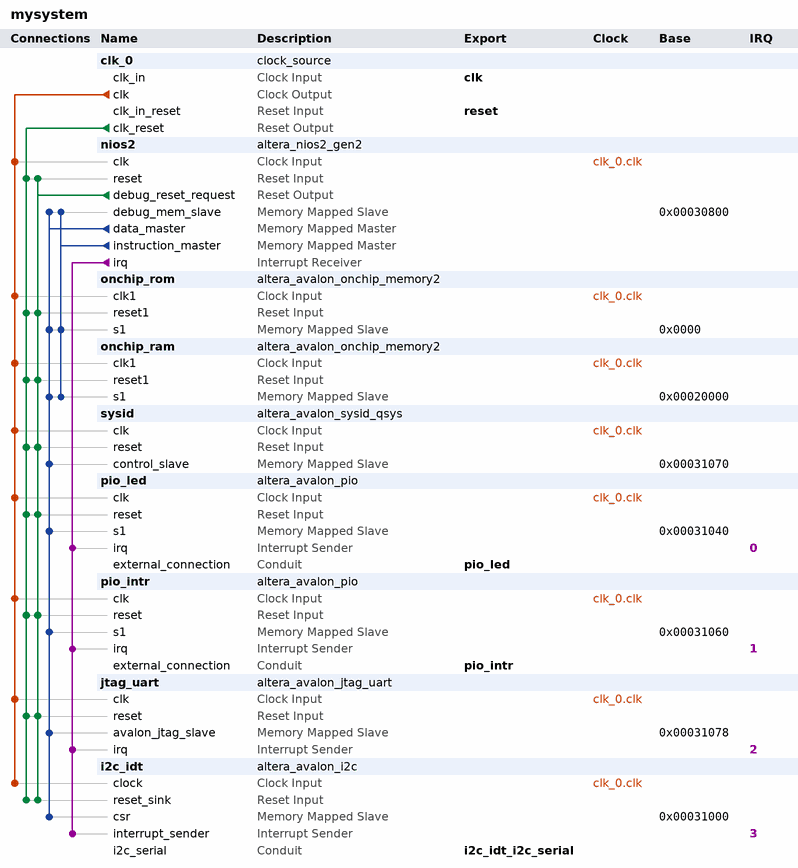
[diagram p0: system contents]
# Platform Designer (Qsys) system mysystem, Stratix V 5SGSMD5K1F40C1
# Parameters at their usual value, and those the tool derives, are not listed.
package require -exact qsys 18.1
create_system mysystem
set_project_property DEVICE_FAMILY {Stratix V}
set_project_property DEVICE 5SGSMD5K1F40C1

add_instance clk_0 clock_source 18.1
set_instance_parameter_value clk_0 clockFrequency 125000000

add_instance nios2 altera_nios2_gen2 18.1
set_instance_parameter_value nios2 dcache_size 2048
set_instance_parameter_value nios2 exceptionSlave onchip_ram.s1
set_instance_parameter_value nios2 icache_size 4096
set_instance_parameter_value nios2 impl Fast
set_instance_parameter_value nios2 resetSlave onchip_rom.s1

add_instance onchip_rom altera_avalon_onchip_memory2 18.1
set_instance_parameter_value onchip_rom dataWidth 32
set_instance_parameter_value onchip_rom dualPort false
set_instance_parameter_value onchip_rom initMemContent true
set_instance_parameter_value onchip_rom initializationFileName onchip_mem.hex
set_instance_parameter_value onchip_rom memorySize 40960
set_instance_parameter_value onchip_rom writable false

add_instance onchip_ram altera_avalon_onchip_memory2 18.1
set_instance_parameter_value onchip_ram dataWidth 32
set_instance_parameter_value onchip_ram dualPort false
set_instance_parameter_value onchip_ram initMemContent true
set_instance_parameter_value onchip_ram initializationFileName onchip_mem.hex
set_instance_parameter_value onchip_ram memorySize 40960

add_instance sysid altera_avalon_sysid_qsys 18.1
set_instance_parameter_value sysid id -2023406815

add_instance pio_led altera_avalon_pio 18.1
set_instance_parameter_value pio_led bitClearingEdgeCapReg true
set_instance_parameter_value pio_led bitModifyingOutReg true
set_instance_parameter_value pio_led captureEdge true
set_instance_parameter_value pio_led direction Bidir
set_instance_parameter_value pio_led generateIRQ true
set_instance_parameter_value pio_led resetValue 255
set_instance_parameter_value pio_led width 8

add_instance pio_intr altera_avalon_pio 18.1
set_instance_parameter_value pio_intr bitClearingEdgeCapReg true
set_instance_parameter_value pio_intr captureEdge true
set_instance_parameter_value pio_intr direction Input
set_instance_parameter_value pio_intr generateIRQ true
set_instance_parameter_value pio_intr irqType EDGE
set_instance_parameter_value pio_intr width 2

add_instance jtag_uart altera_avalon_jtag_uart 18.1
set_instance_parameter_value jtag_uart simInteractiveOptions NO_INTERACTIVE_WINDOWS

add_instance i2c_idt altera_avalon_i2c 18.1
set_instance_parameter_value i2c_idt FIFO_DEPTH 4

# connections
add_connection clk_0.clk i2c_idt.clock clock
add_connection clk_0.clk jtag_uart.clk clock
add_connection clk_0.clk nios2.clk clock
add_connection clk_0.clk onchip_ram.clk1 clock
add_connection clk_0.clk onchip_rom.clk1 clock
add_connection clk_0.clk pio_intr.clk clock
add_connection clk_0.clk pio_led.clk clock
add_connection clk_0.clk sysid.clk clock
add_connection clk_0.clk_reset i2c_idt.reset_sink reset
add_connection clk_0.clk_reset jtag_uart.reset reset
add_connection clk_0.clk_reset nios2.reset reset
add_connection clk_0.clk_reset onchip_ram.reset1 reset
add_connection clk_0.clk_reset onchip_rom.reset1 reset
add_connection clk_0.clk_reset pio_intr.reset reset
add_connection clk_0.clk_reset pio_led.reset reset
add_connection clk_0.clk_reset sysid.reset reset
add_connection nios2.debug_reset_request i2c_idt.reset_sink reset
add_connection nios2.debug_reset_request jtag_uart.reset reset
add_connection nios2.debug_reset_request nios2.reset reset
add_connection nios2.debug_reset_request onchip_ram.reset1 reset
add_connection nios2.debug_reset_request onchip_rom.reset1 reset
add_connection nios2.debug_reset_request pio_intr.reset reset
add_connection nios2.debug_reset_request pio_led.reset reset
add_connection nios2.debug_reset_request sysid.reset reset
add_connection nios2.data_master i2c_idt.csr avalon
set_connection_parameter_value nios2.data_master/i2c_idt.csr baseAddress 0x00031000
add_connection nios2.data_master jtag_uart.avalon_jtag_slave avalon
set_connection_parameter_value nios2.data_master/jtag_uart.avalon_jtag_slave baseAddress 0x00031078
add_connection nios2.data_master nios2.debug_mem_slave avalon
set_connection_parameter_value nios2.data_master/nios2.debug_mem_slave baseAddress 0x00030800
add_connection nios2.data_master onchip_ram.s1 avalon
set_connection_parameter_value nios2.data_master/onchip_ram.s1 baseAddress 0x00020000
add_connection nios2.data_master onchip_rom.s1 avalon
set_connection_parameter_value nios2.data_master/onchip_rom.s1 baseAddress 0x0000
add_connection nios2.data_master pio_intr.s1 avalon
set_connection_parameter_value nios2.data_master/pio_intr.s1 baseAddress 0x00031060
add_connection nios2.data_master pio_led.s1 avalon
set_connection_parameter_value nios2.data_master/pio_led.s1 baseAddress 0x00031040
add_connection nios2.data_master sysid.control_slave avalon
set_connection_parameter_value nios2.data_master/sysid.control_slave baseAddress 0x00031070
add_connection nios2.instruction_master nios2.debug_mem_slave avalon
set_connection_parameter_value nios2.instruction_master/nios2.debug_mem_slave baseAddress 0x00030800
add_connection nios2.instruction_master onchip_ram.s1 avalon
set_connection_parameter_value nios2.instruction_master/onchip_ram.s1 baseAddress 0x00020000
add_connection nios2.instruction_master onchip_rom.s1 avalon
set_connection_parameter_value nios2.instruction_master/onchip_rom.s1 baseAddress 0x0000
add_connection nios2.irq i2c_idt.interrupt_sender interrupt
set_connection_parameter_value nios2.irq/i2c_idt.interrupt_sender irqNumber 3
add_connection nios2.irq jtag_uart.irq interrupt
set_connection_parameter_value nios2.irq/jtag_uart.irq irqNumber 2
add_connection nios2.irq pio_intr.irq interrupt
set_connection_parameter_value nios2.irq/pio_intr.irq irqNumber 1
add_connection nios2.irq pio_led.irq interrupt
set_connection_parameter_value nios2.irq/pio_led.irq irqNumber 0

# exported interfaces
add_interface clk clock sink
set_interface_property clk EXPORT_OF clk_0.clk_in
add_interface i2c_idt_i2c_serial conduit end
set_interface_property i2c_idt_i2c_serial EXPORT_OF i2c_idt.i2c_serial
add_interface pio_intr conduit end
set_interface_property pio_intr EXPORT_OF pio_intr.external_connection
add_interface pio_led conduit end
set_interface_property pio_led EXPORT_OF pio_led.external_connection
add_interface reset reset sink
set_interface_property reset EXPORT_OF clk_0.clk_in_reset

set_interconnect_requirement {$system} qsys_mm.clockCrossingAdapter HANDSHAKE
set_interconnect_requirement {$system} qsys_mm.enableEccProtection FALSE
set_interconnect_requirement {$system} qsys_mm.insertDefaultSlave FALSE
set_interconnect_requirement {$system} qsys_mm.maxAdditionalLatency 1

save_system mysystem.qsys
